# Altium schematic sheet PSRAM_SPI.SchDoc: SRAM
size A4; DrawnBy: Michael Watzek; Organization: HTL Hollabrunn; Address1: Abteilung Elektronik; Address2: Anton Ehrenfried-Straße 10; Address3: 2020 Hollabrunn; DocumentNumber: 08; Revision: 02; SheetNumber: 08; SheetTotal: 12; SPICEModelCacheKLVIFSCJ: <root> / <DocumentId>KLVIFSCJ</DocumentId> / <CacheFrame Number="0"> / <Model Name="cap" Kind="MDL"> / <Text>*Default semiconductor capacitor / .MODEL CAP C()</Text> / </Model> / </CacheFrame> / </root>
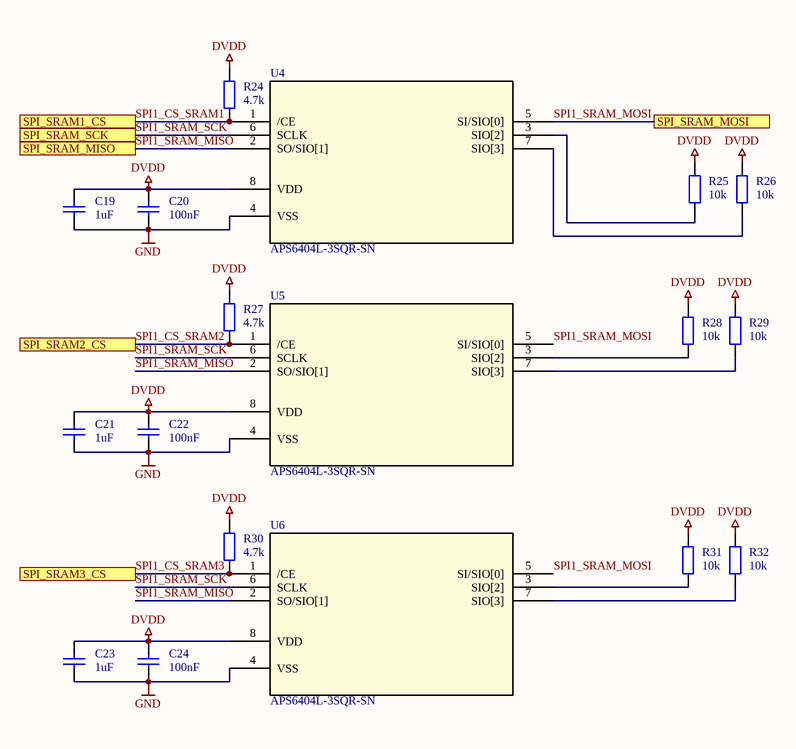
[diagram p0: PSRAM_SPI.SchDoc]

## Parts
C19  1uF  [C1206-KUE]
C20  100nF  [C1206-KUE]
C21  1uF  [C1206-KUE]
C22  100nF  [C1206-KUE]
C23  1uF  [C1206-KUE]
C24  100nF  [C1206-KUE]
R24  4.7k  [C1206-KUE]
R25  10k  [C1206-KUE]
R26  10k  [C1206-KUE]
R27  4.7k  [C1206-KUE]
R28  10k  [C1206-KUE]
R29  10k  [C1206-KUE]
R30  4.7k  [C1206-KUE]
R31  10k  [C1206-KUE]
R32  10k  [C1206-KUE]
U4  APS6404L-3SQR-SN  [APS6404L-3SQR-SN_APY]
U5  APS6404L-3SQR-SN  [APS6404L-3SQR-SN_APY]
U6  APS6404L-3SQR-SN  [APS6404L-3SQR-SN_APY]

## Ports
SPI_SRAM1_CS, SPI_SRAM2_CS, SPI_SRAM3_CS, SPI_SRAM_MISO, SPI_SRAM_MOSI, SPI_SRAM_SCK

## Nets
DVDD: C19.2 C20.2 C21.2 C22.2 C23.2 C24.2 R24.1 R25.1 R26.1 R27.1 R28.1 R29.1 R30.1 R31.1 R32.1 U4.8(VDD) U5.8(VDD) U6.8(VDD)
GND: C19.1 C20.1 C21.1 C22.1 C23.1 C24.1 U4.4(VSS) U5.4(VSS) U6.4(VSS)
SPI1_CS_SRAM1: R24.2 U4.1(/CE) ; port SPI_SRAM1_CS
SPI1_CS_SRAM2: R27.2 U5.1(/CE) ; port SPI_SRAM2_CS
SPI1_CS_SRAM3: R30.2 U6.1(/CE) ; port SPI_SRAM3_CS
SPI1_SRAM_MISO: U4.2(SO/SIO[1]) U5.2(SO/SIO[1]) U6.2(SO/SIO[1]) ; port SPI_SRAM_MISO
SPI1_SRAM_MOSI: U4.5(SI/SIO[0]) U5.5(SI/SIO[0]) U6.5(SI/SIO[0]) ; port SPI_SRAM_MOSI
SPI1_SRAM_SCK: U4.6(SCLK) U5.6(SCLK) U6.6(SCLK) ; port SPI_SRAM_SCK
NetR25_2: R25.2 U4.3(SIO[2])
NetR26_2: R26.2 U4.7(SIO[3])
NetR28_2: R28.2 U5.3(SIO[2])
NetR29_2: R29.2 U5.7(SIO[3])
NetR31_2: R31.2 U6.3(SIO[2])
NetR32_2: R32.2 U6.7(SIO[3])

## Notes on the sheet
- Title
- Size:
- Date:
- A4
- Number:
- Time:
- Revision:
- Sheet
- of
- HTL Hollabrunn
- Abteilung Elektronik
- Anton Ehrenfried-Straße 10
- 2020 Hollabrunn
- File:
- Drawn By:

## Library data of the parts
C19-C24 = Capacitor: Manufacturer: Kemet; Bezeichnung: Kerko +-10% 63V; Published: 8-Jun-2000; LatestRevisionDate: 17-Jul-2002; LatestRevisionNote: Re-released for DXP Platform.; PackageReference: RAD-0.3; Publisher: Altium Limited; PackageDescription: Radial Cap, Thru-Hole; 2 Leads; 0.3 in Pin Spacing; Orderingcode: *
  C19 C21 C23: Value: 1uF
  C20 C22 C24: Value: 100nF
R24-R32 = ResistorSMD: Resistor SMD; Manufacturer: AVX; Bezeichnung: SMD Wid. 1/8W 2%; Published: 8-Jun-2000; LatestRevisionDate: 17-Jul-2002; LatestRevisionNote: Re-released for DXP Platform.; PackageReference: AXIAL-0.4; Publisher: Altium Limited; PackageDescription: Axial Device, Thru-Hole; 2 Leads; 0.4 in Pin Spacing; Orderingcode: *
  R24 R27 R30: Value: 4.7k
  R25 R26 R28 R29 R31 R32: Value: 10k
U4-U6 = APS6404L-3SQR-SN: Description; Manufacturer_Name: AP Memory; Copyright: Copyright (C) 2025 Ultra Librarian. All rights reserved.; Manufacturer_Part_Number: APS6404L-3SQR-SN; RefDes: RefDes; Type: Type